# EasyEDA Pro project 智能水杯垫.epro, board PCB5
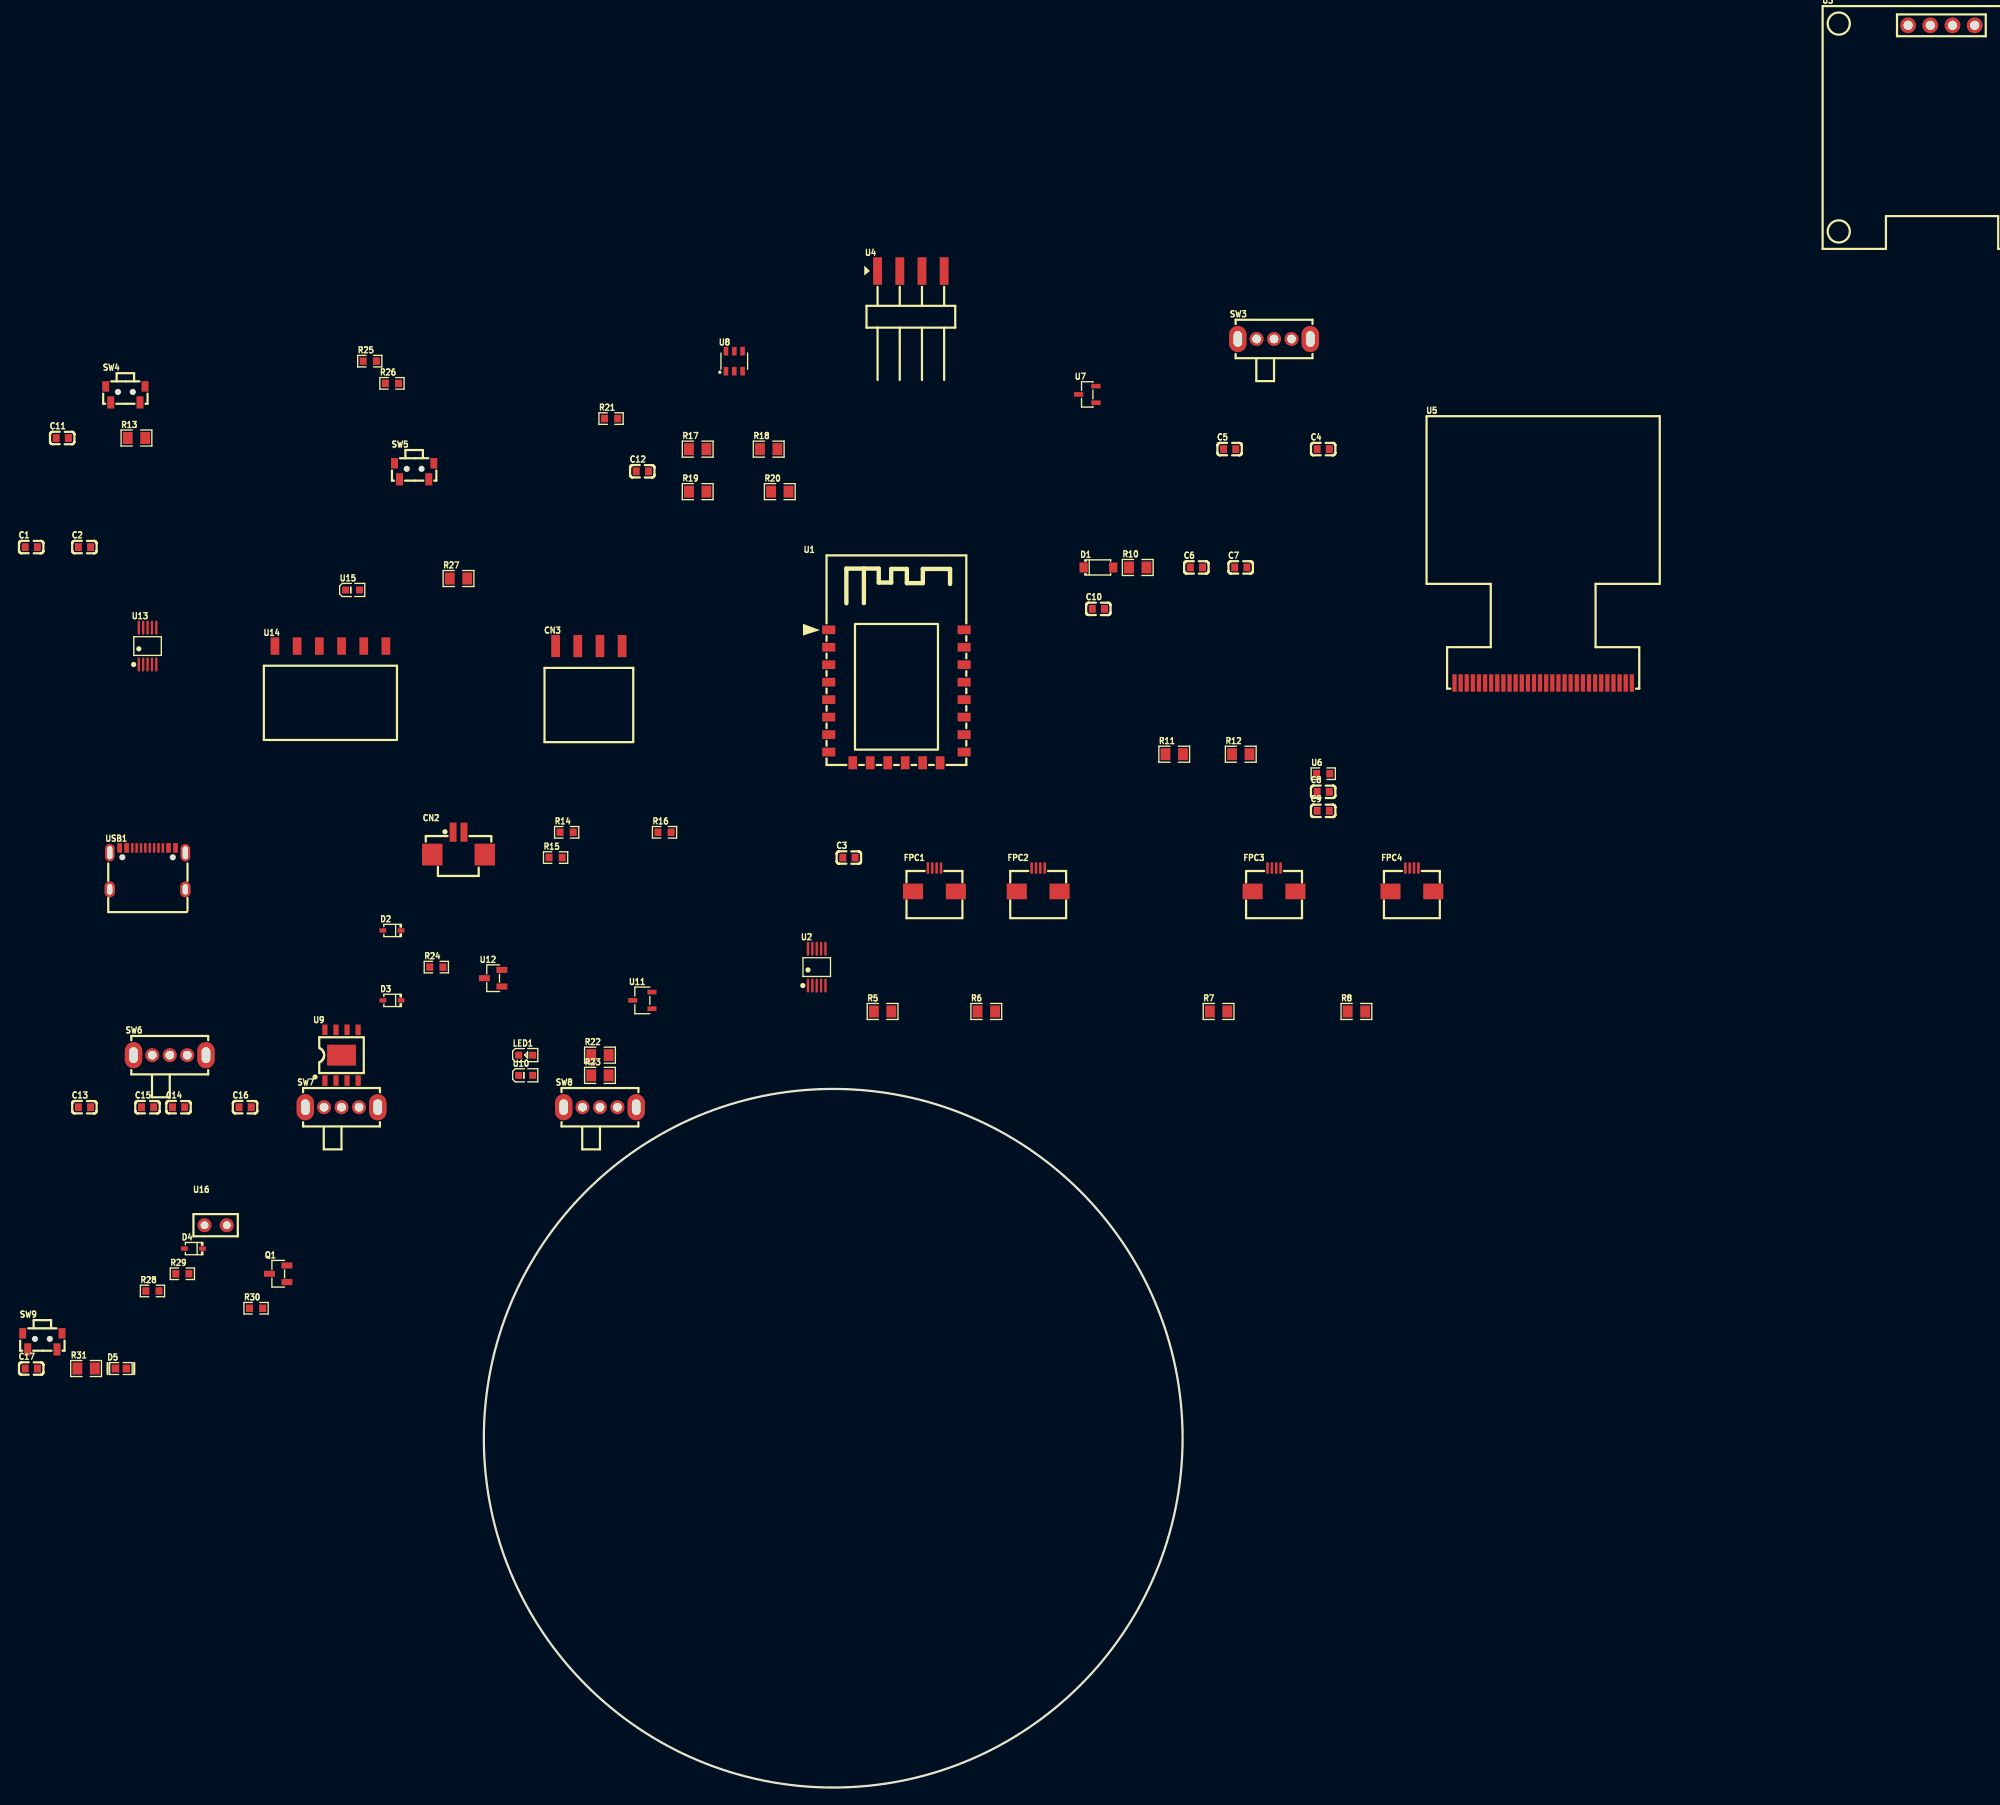
[diagram p2: board, top side]
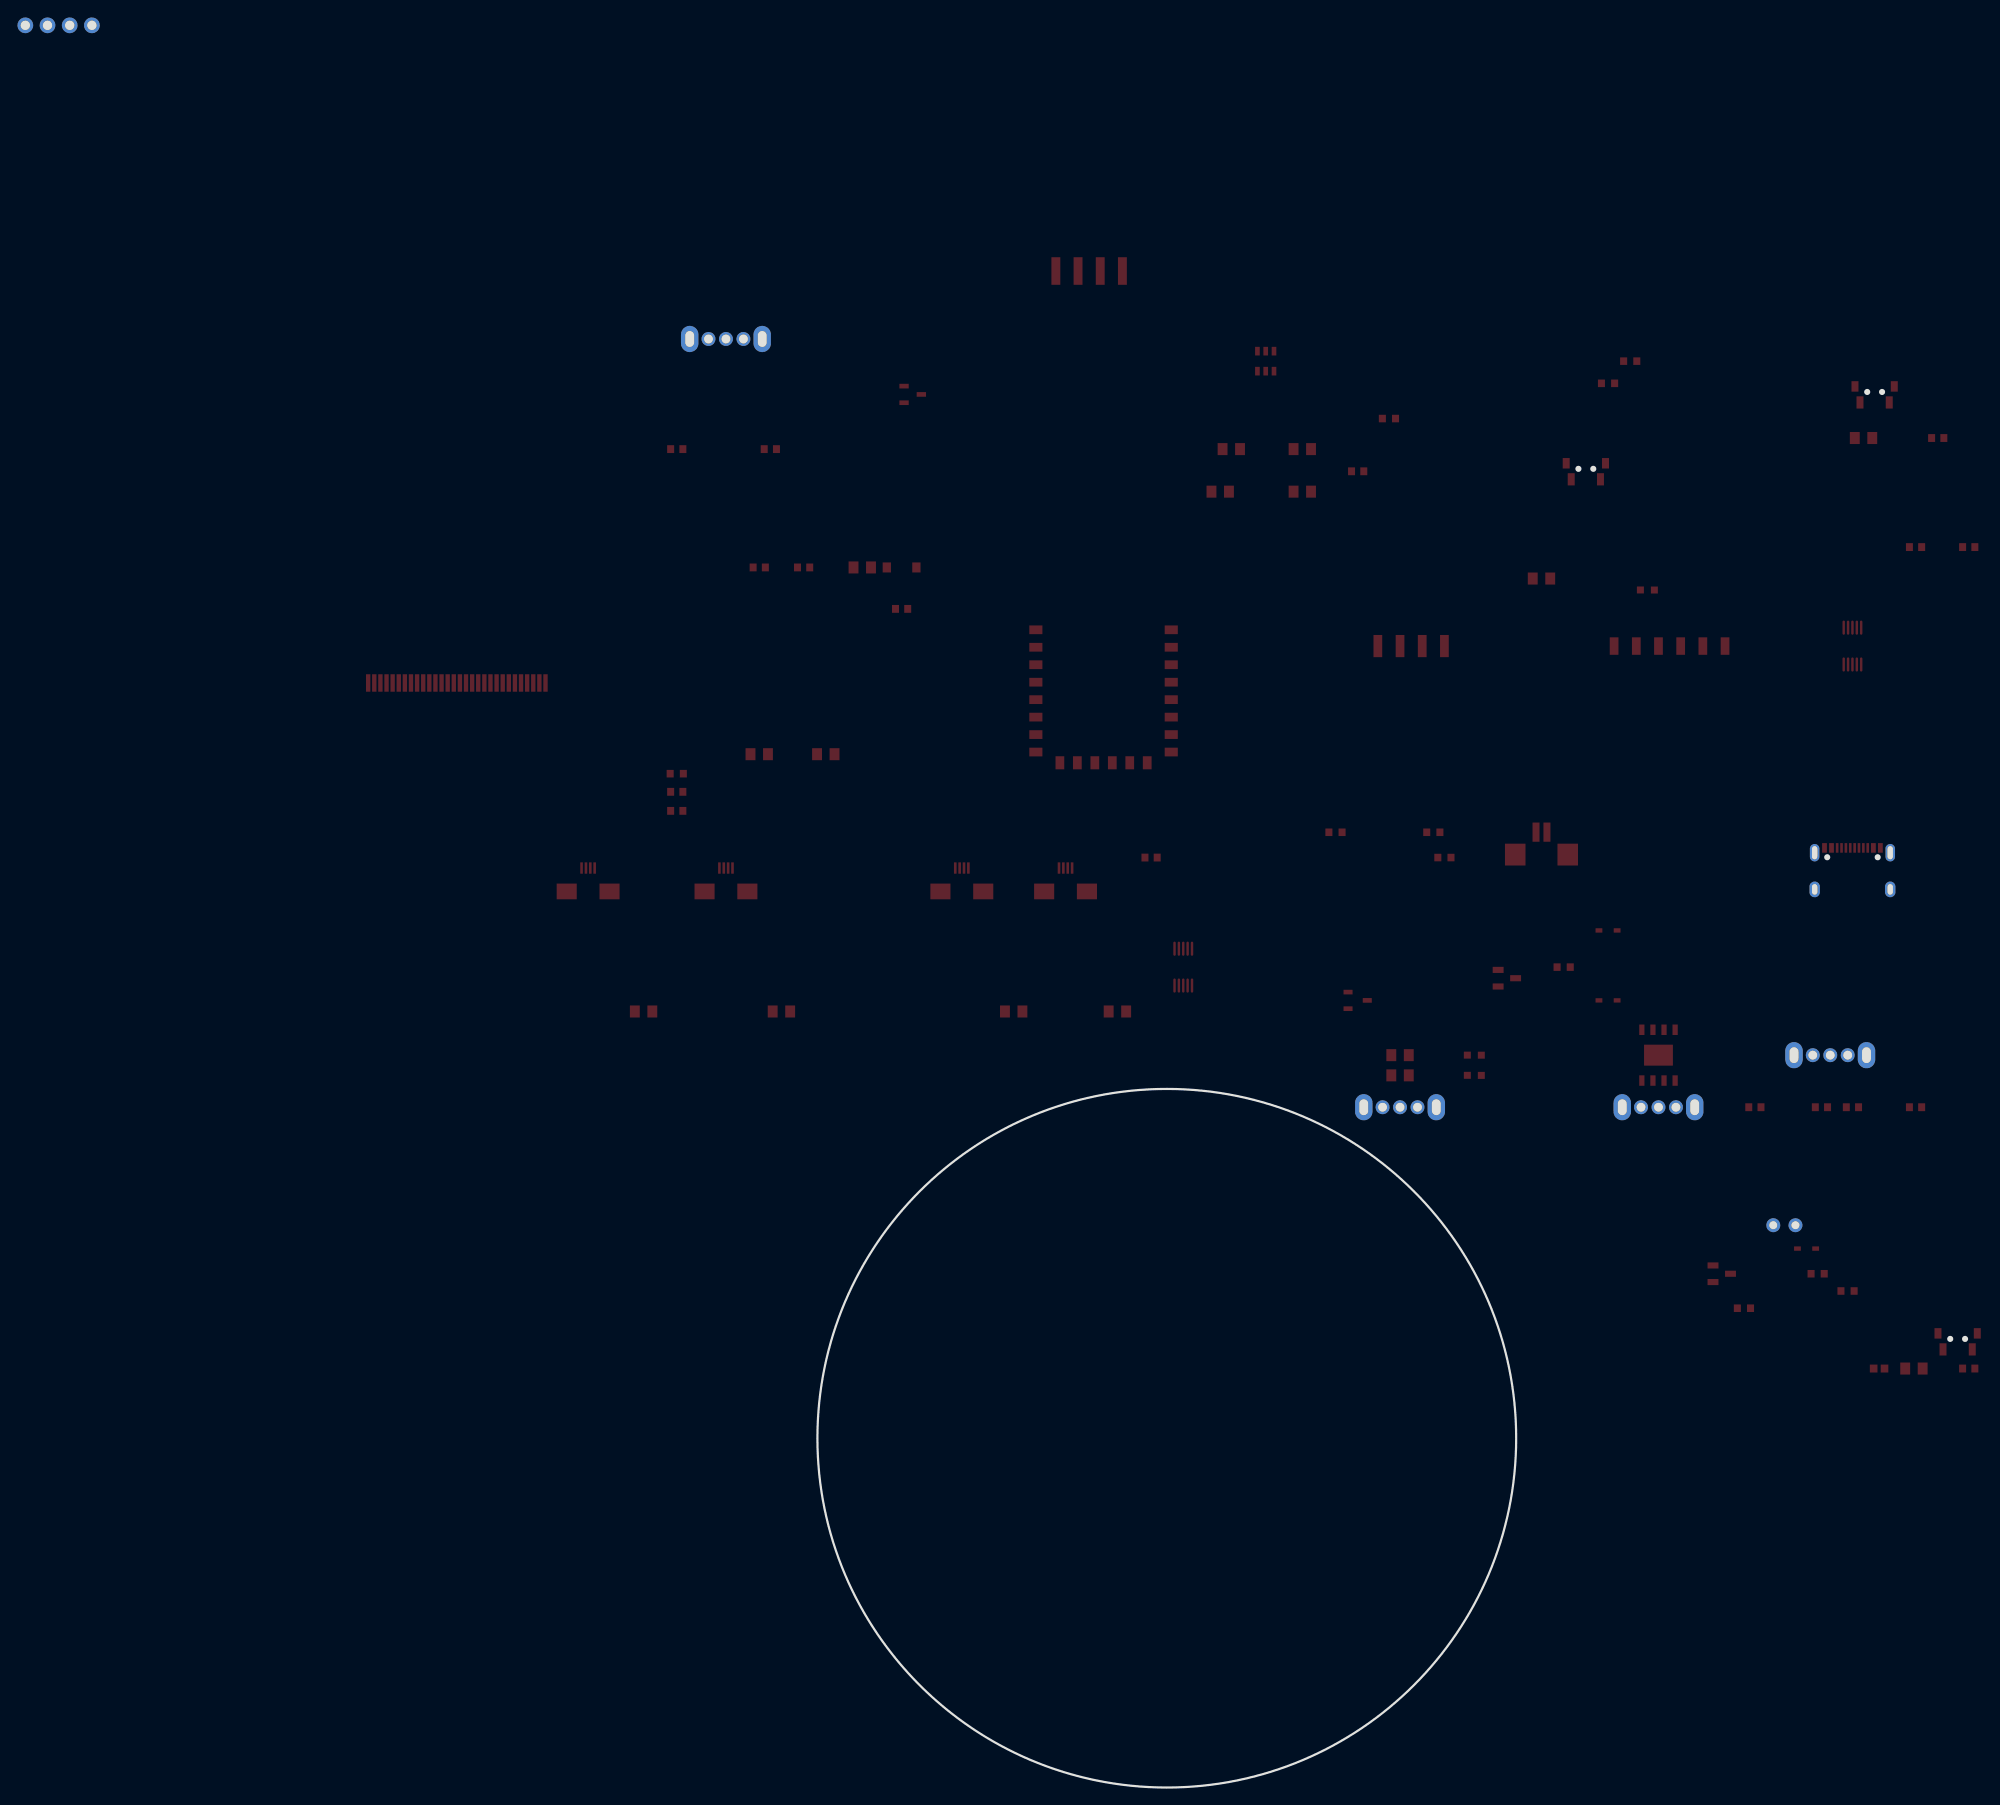
[diagram p3: board, bottom side, seen from below]

Outline 131.74 x 160.16 mm; copper layers: Top Layer, Bottom Layer. Coordinates in mm from the lower left corner of the outline.
Outline path: circle c91.74,40 r40
Stack: Top Layer 0.035mm / Dielectric1 1.51mm FR4 er 4.5 / Bottom Layer 0.035mm

## Design rules (mm)
template: JLCPCB Capability(Two Layers Board)
spacing copperThickness1oz (default): track to track 0.102, other pairs 0.152 to 0.3
spacing copperThickness2oz: track to track 0.203, other pairs 0.152 to 0.3
track width copperThickness1oz (default): min 0.127, default 0.254, max 2.54
track width copperThickness2oz: min 0.203, default 0.254, max 2.54
differential pair differentialPair (default): width min 0.127, default 0.254, max 2.54; gap min 0.152, default 0.152
via viaSize (default): diameter min 0.5, default 0.61, max 10; hole min 0.3, default 0.305, max 6.3

## Placement (name value [footprint] x y rotation side)
C1  10nF  [C0603]  -0.07 142.05 0 top
C2  10nF  [C0603]  6.02 142.05 0 top
C3  100nF  [C0603]  93.54 106.5 0 top
C4  1uF  [C0603]  147.84 153.27 0 top
C5  1uF  [C0603]  137.13 153.27 0 top
C6  1uF  [C0603]  133.32 139.72 0 top
C7  1uF  [C0603]  138.4 139.72 0 top
C8  4.7uF  [C0603]  147.84 114.02 0 top
C9  2.2uF  [C0603]  147.84 111.84 0 top
C10  4.7uF  [C0603]  122.1 134.97 0 top
C11  10nF  [C0603]  3.48 154.54 0 top
C12  15pF  [C0603]  69.89 150.73 0 top
C13  10uF  [C0603]  6.02 77.91 0 top
C14  10uF  [C0603]  16.79 77.91 0 top
C15  100nF  [C0603]  13.24 77.91 0 top
C16  100nF  [C0603]  24.41 77.91 0 top
C17  100nF  [C0603]  -0.07 47.98 0 top
CN2  HC-1.25-2PWT  [CONN-SMD_2P-P1.25-HC-1.25-2PWT]  48.84 108.12 0 top
CN3  X6511FRS-04-C85D30  [HDR-SMD_4P-P2.54-H-F]  63.77 130.71 0 top
D1  1N4148W  [SOD-123_L2.8-W1.8-LS3.7-RD-1]  122.1 139.72 0 top
D2  B5819WS  [SOD-323_L1.7-W1.3-LS2.5-FD]  41.22 98.15 0 top
D3  B5819WS  [SOD-323_L1.7-W1.3-LS2.5-FD]  41.22 90.14 0 top
D4  B5819WS  [SOD-323_L1.7-W1.3-LS2.5-FD]  18.49 61.72 0 top
D5  0603ESDA-05N  [D0603-BI]  10.19 47.98 0 top
FPC1  AFC01-S04FCC-00  [FFC-SMD_4P-P0.50_AFC01-S04FCC-00]  103.33 103.96 0 top
FPC2  AFC01-S04FCC-00  [FFC-SMD_4P-P0.50_AFC01-S04FCC-00]  115.2 103.96 0 top
FPC3  AFC01-S04FCC-00  [FFC-SMD_4P-P0.50_AFC01-S04FCC-00]  142.21 103.96 0 top
FPC4  AFC01-S04FCC-00  [FFC-SMD_4P-P0.50_AFC01-S04FCC-00]  157.99 103.96 0 top
LED1  XL-1608SURC-06  [LED0603-RD_RED]  56.53 83.87 0 top
Q1  2N7002K  [SOT-23-3_L2.9-W1.3-P1.90-LS2.4-BR]  28.2 58.84 0 top
R5  4.7kΩ  [R0805]  97.39 88.87 0 top
R6  4.7kΩ  [R0805]  109.27 88.87 0 top
R7  4.7kΩ  [R0805]  135.86 88.87 0 top
R8  4.7kΩ  [R0805]  151.64 88.87 0 top
R10  4.7kΩ  [R0805]  126.6 139.72 0 top
R11  4.7kΩ  [R0805]  130.78 118.33 0 top
R12  4.7kΩ  [R0805]  138.4 118.33 0 top
R13  4.7kΩ  [R0805]  11.97 154.54 0 top
R14  10kΩ  [R0603]  61.23 109.39 0 top
R15  10kΩ  [R0603]  59.96 106.5 0 top
R16  10kΩ  [R0603]  72.43 109.39 0 top
R17  4.7kΩ  [R0805]  76.23 153.27 0 top
R18  4.7kΩ  [R0805]  84.35 153.27 0 top
R19  4.7kΩ  [R0805]  76.23 148.4 0 top
R20  4.7kΩ  [R0805]  85.62 148.4 0 top
R21  0Ω  [R0603]  66.31 156.77 0 top
R22  4.7kΩ  [R0805]  65.04 83.87 0 top
R23  4.7kΩ  [R0805]  65.04 81.55 0 top
R24  10kΩ  [R0603]  46.3 93.95 0 top
R25  300Ω  [R0603]  38.68 163.34 0 top
R26  300Ω  [R0603]  41.22 160.8 0 top
R27  4.7kΩ  [R0805]  48.84 138.45 0 top
R28  10kΩ  [R0603]  13.8 56.86 0 top
R29  1kΩ  [R0603]  17.22 58.84 0 top
R30  0Ω  [R0603]  25.66 54.89 0 top
R31  4.7kΩ  [R0805]  6.2 47.98 0 top
SW3  SK12D07VG5  [SW-TH_SK12D07VG5]  142.21 165.88 0 top
SW4  TS24CA 250gf 013  [SW-SMD_L4.7-W3.5-P3.35-EH]  10.7 159.53 0 top
SW5  TS24CA 250gf 013  [SW-SMD_L4.7-W3.5-P3.35-EH]  43.76 150.73 0 top
SW6  SK12D07VG5  [SW-TH_SK12D07VG5]  15.78 83.87 0 top
SW7  SK12D07VG5  [SW-TH_SK12D07VG5]  35.45 77.91 0 top
SW8  SK12D07VG5  [SW-TH_SK12D07VG5]  65.04 77.91 0 top
SW9  TS24CA 250gf 013  [SW-SMD_L4.7-W3.5-P3.35-EH]  1.2 51.09 0 top
U1  2.4GHz  [wifim-smd_esp-f]  98.98 124.96 0 top
U2  ADS1115IDGSR  [MSOP-10_L3.0-W3.0-P0.50-LS5.0-BL]  89.85 93.95 0 top
U3  HS96L03W2C03  [OLED-TH_L27.8-W27.2-P2.54_C9900033791]  218.61 201.8 0 top
U4  X6511WRS-04H-C60D48  [HDR-SMD_4P-P2.54-H-M-W13.3-N]  100.63 173.66 0 top
U5  X096-2864KSWAG01-H30  [LCD-SMD_X096-2864KSWAG01-H30]  173.02 126.49 0 top
U6  910kΩ  [R0603]  147.84 116.1 0 top
U7  S8050  [SOT-23-3_L2.9-W1.3-P1.90-LS2.3-BR]  120.83 159.53 0 top
U8  TTP233H-BA6  [SOT-23-6_L2.9-W1.7-P0.95-LS2.8-BL]  80.41 163.34 0 top
U9  TP4056  [ESOP-8_L4.9-W3.9-P1.27-LS6.0-BL-EP]  35.45 83.87 0 top
U10  XL-1608PGC-06  [LED0603-RD_GREEN]  56.53 81.55 0 top
U11  XC6206P332MR  [SOT-23-3_L3.0-W1.7-P0.95-LS2.9-BR]  69.89 90.14 0 top
U12  BSS84  [SOT-23-3_L2.9-W1.3-P1.90-LS2.4-BR-1]  52.8 92.68 0 top
U13  CH340E  [MSOP-10_L3.0-W3.0-P0.50-LS5.0-BL]  13.24 130.71 0 top
U14  X6511FRS-06-C85D30  [HDR-SMD_6P-P2.54-H-F-L11.5]  34.18 130.71 0 top
U15  XL-1608PGC-06  [LED0603-RD_GREEN]  36.72 137.13 0 top
U16  LCM0827A3038F  [VIBRATIONMOTOR-TH_LCM0827A3038F]  21.03 64.39 0 top
USB1  TYPE-C 16PIN 2MD(073)  [USB-C-SMD_TYPE-C-6PIN-2MD-073]  13.24 105.23 0 top

## Footprints (pads in the part's own frame, mm; a bottom-side part is the same pattern mirrored in y, then rotated)
C0603
  rect 0.8x0.9 smd: 1(-0.7,0) 2(0.7,0)
CONN-SMD_2P-P1.25-HC-1.25-2PWT
  rect 0.8x2.2 smd: 1(-0.625,1.285) 2(0.625,1.285)
  rect 2.35x2.5 smd: 3(-3.005,-1.285) 4(3.005,-1.285)
D0603-BI
  rect 0.873x0.907 smd: 1(-0.622,0) 2(0.622,0)
ESOP-8_L4.9-W3.9-P1.27-LS6.0-BL-EP
  rect 0.6x1.2 smd: 1(-1.905,-2.909) 2(-0.635,-2.909) 3(0.635,-2.909) 4(1.905,-2.909) 5(1.905,2.909) 6(0.635,2.909) 7(-0.635,2.909) 8(-1.905,2.909)
  rect 3.3x2.4 smd: 9(0,0)
FFC-SMD_4P-P0.50_AFC01-S04FCC-00
  rect 0.3x1.3 smd: 1(-0.75,1.34) 2(-0.25,1.34) 3(0.25,1.34) 4(0.75,1.34)
  rect 2.3x1.8 smd: 5(2.45,-1.34) 6(-2.45,-1.34)
HDR-SMD_4P-P2.54-H-F
  rect 1x2.54 smd: 1(-3.81,0) 2(-1.27,0) 3(1.27,0) 4(3.81,0)
HDR-SMD_4P-P2.54-H-M-W13.3-N
  rect 1.02x3.16 smd: 1(-3.81,0) 2(-1.27,0) 3(1.27,0) 4(3.81,0)
HDR-SMD_6P-P2.54-H-F-L11.5
  rect 1x2 smd: 1(-6.35,0) 2(-3.81,0) 3(-1.27,0) 4(1.27,0) 5(3.81,0) 6(6.35,0)
LCD-SMD_X096-2864KSWAG01-H30
  rect 0.5x2 smd: 1(-10.15,0) 2(-9.45,0) 3(-8.75,0) 4(-8.05,0) 5(-7.35,0) 6(-6.65,0) 7(-5.95,0) 8(-5.25,0) 9(-4.55,0) 10(-3.85,0) 11(-3.15,0) 12(-2.45,0) 13(-1.75,0) 14(-1.05,0) 15(-0.35,0) 16(0.35,0) 17(1.05,0) 18(1.75,0) 19(2.45,0) 20(3.15,0) 21(3.85,0) 22(4.55,0) 23(5.25,0) 24(5.95,0) 25(6.65,0) 26(7.35,0) 27(8.05,0) 28(8.75,0) 29(9.45,0) 30(10.15,0)
LED0603-RD_GREEN
  rect 0.8x0.8 smd: 1(-0.799,-0.004) 2(0.799,0.004)
LED0603-RD_RED
  rect 0.8x0.8 smd: 1(-0.799,-0.004) 2(0.799,0.004)
MSOP-10_L3.0-W3.0-P0.50-LS5.0-BL
  oval 0.28x1.62 smd: 1(-1,-2.11) 2(-0.5,-2.11) 3(0,-2.11) 4(0.5,-2.11) 5(1,-2.11) 6(1,2.11) 7(0.5,2.11) 8(0,2.11) 9(-0.5,2.11) 10(-1,2.11)
OLED-TH_L27.8-W27.2-P2.54_C9900033791
  round 1.8 hole 1.05: 1(-3.81,0) 2(-1.27,0) 3(1.27,0) 4(3.81,0)
R0603
  rect 0.806x0.864 smd: 1(-0.753,0) 2(0.753,0)
R0805
  rect 1.133x1.377 smd: 1(-1,0) 2(1,0)
SOD-123_L2.8-W1.8-LS3.7-RD-1
  rect 0.95x1.15 smd: 1(-1.692,0) 2(1.692,0)
SOD-323_L1.7-W1.3-LS2.5-FD
  rect 0.78x0.5 smd: 1(-1.04,0) 2(1.04,0)
SOT-23-3_L2.9-W1.3-P1.90-LS2.3-BR
  rect 1.07x0.532 smd: 1(0.99,-0.95) 2(0.99,0.95) 3(-0.99,0)
SOT-23-3_L2.9-W1.3-P1.90-LS2.4-BR
  rect 1.25x0.7 smd: 1(1,-0.95) 2(1,0.95) 3(-1,0)
SOT-23-3_L2.9-W1.3-P1.90-LS2.4-BR-1
  rect 1.25x0.7 smd: 1(1,-0.95) 2(1,0.95) 3(-1,0)
SOT-23-3_L3.0-W1.7-P0.95-LS2.9-BR
  rect 1.038x0.532 smd: 1(1.101,-0.95) 2(1.101,0.95) 3(-1.101,0)
SOT-23-6_L2.9-W1.7-P0.95-LS2.8-BL
  rect 0.532x0.99 smd: 1(-0.95,-1.145) 2(0,-1.145) 3(0.95,-1.145) 4(0.95,1.145) 5(0,1.145) 6(-0.95,1.145)
SW-SMD_L4.7-W3.5-P3.35-EH
  rect 0.8x1.4 smd: 1(-1.675,-0.917) 2(1.675,-0.917)
  rect 0.8x1.2 smd: 3(-2.25,0.917) 4(2.25,0.917)
SW-TH_SK12D07VG5
  oval 1.6x1.6 hole 1: 1(-2,0) 2(0,0) 3(2,0)
  oval 2x3 hole 1x1.8: 4(4.15,0) 5(-4.15,0)
USB-C-SMD_TYPE-C-6PIN-2MD-073
  rect 0.55x1.1 smd: 1(-3.2,2.375) 2(-2.4,2.375) 11(2.4,2.375) 12(3.2,2.375)
  rect 0.3x1.1 smd: 3(-1.75,2.375) 4(-1.25,2.375) 5(-0.75,2.375) 6(-0.25,2.375) 7(0.25,2.375) 8(0.75,2.375) 9(1.25,2.375) 10(1.75,2.375)
  oval 1.1x2 hole 0.6x1.5: 13(-4.325,1.825) 14(4.325,1.825)
  oval 1.2x1.8 hole 0.6x1.2: 13(-4.325,-2.375) 14(4.325,-2.375)
VIBRATIONMOTOR-TH_LCM0827A3038F
  round 1.6 hole 0.9: 1(-1.27,0) 2(1.27,0)
wifim-smd_esp-f
  rect 1.5x1 smd: 1(-7.75,7.615) 2(-7.75,5.615) 3(-7.75,3.615) 4(-7.75,1.615) 5(-7.75,-0.385) 6(-7.75,-2.385) 7(-7.75,-4.385) 8(-7.75,-6.385) 15(7.75,-6.385) 16(7.75,-4.385) 17(7.75,-2.385) 18(7.75,-0.385) 19(7.75,1.615) 20(7.75,3.615) 21(7.75,5.615) 22(7.75,7.615)
  rect 1x1.5 smd: 9(-5,-7.615) 10(-3,-7.615) 11(-1,-7.615) 12(1,-7.615) 13(3,-7.615) 14(5,-7.615)

## Nets
As in the schematic.

Pads without a net: SW3 3; SW4 4; SW6 3; SW7 3; SW8 3; U2 1 2; U5 7; U13 4 5 6 10; USB1 3 4 9 10
